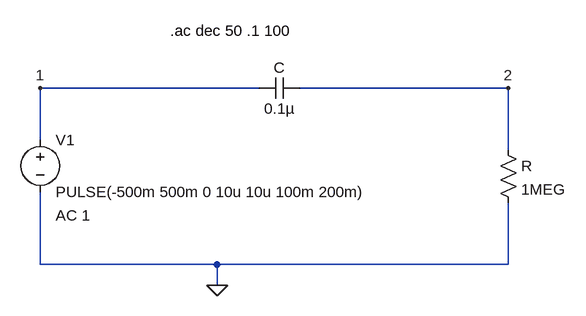
[diagram p0: schematic Auf_3.2_.asc]
Auf_3.2_.asc, the LTspice schematic file:
Version 4
SHEET 1 900 680
WIRE 416 -32 80 -32
WIRE 800 -32 480 -32
WIRE 80 48 80 -32
WIRE 800 64 800 -32
WIRE 80 240 80 128
WIRE 352 240 80 240
WIRE 800 240 800 144
WIRE 800 240 352 240
WIRE 352 272 352 240
FLAG 80 -32 1
FLAG 800 -32 2
FLAG 352 272 0
SYMBOL voltage 80 32 R0
WINDOW 123 24 132 Left 0
WINDOW 39 0 0 Left 0
SYMATTR InstName V1
SYMATTR Value PULSE(-500m 500m 0 10u 10u 100m 200m)
SYMATTR Value2 AC 1
SYMBOL cap 480 -48 R90
WINDOW 0 0 32 VBottom 0
WINDOW 3 32 32 VTop 0
SYMATTR InstName C
SYMATTR Value 0.1µ
SYMBOL res 784 48 R0
SYMATTR InstName R
SYMATTR Value 1MEG
TEXT 280 -120 Left 0 !.ac dec 50 .1 100

The netlist it stands for:
* Auf_3.2_.asc
V1 1 0 PULSE(-500m 500m 0 10u 10u 100m 200m) AC 1
C 2 1 0.1µ
R 2 0 1MEG
.ac dec 50 .1 100
.backanno
.end